# Altium schematic sheet Duubel_v3.SchDoc
size A4; SheetNumber: 1; SheetTotal: 1
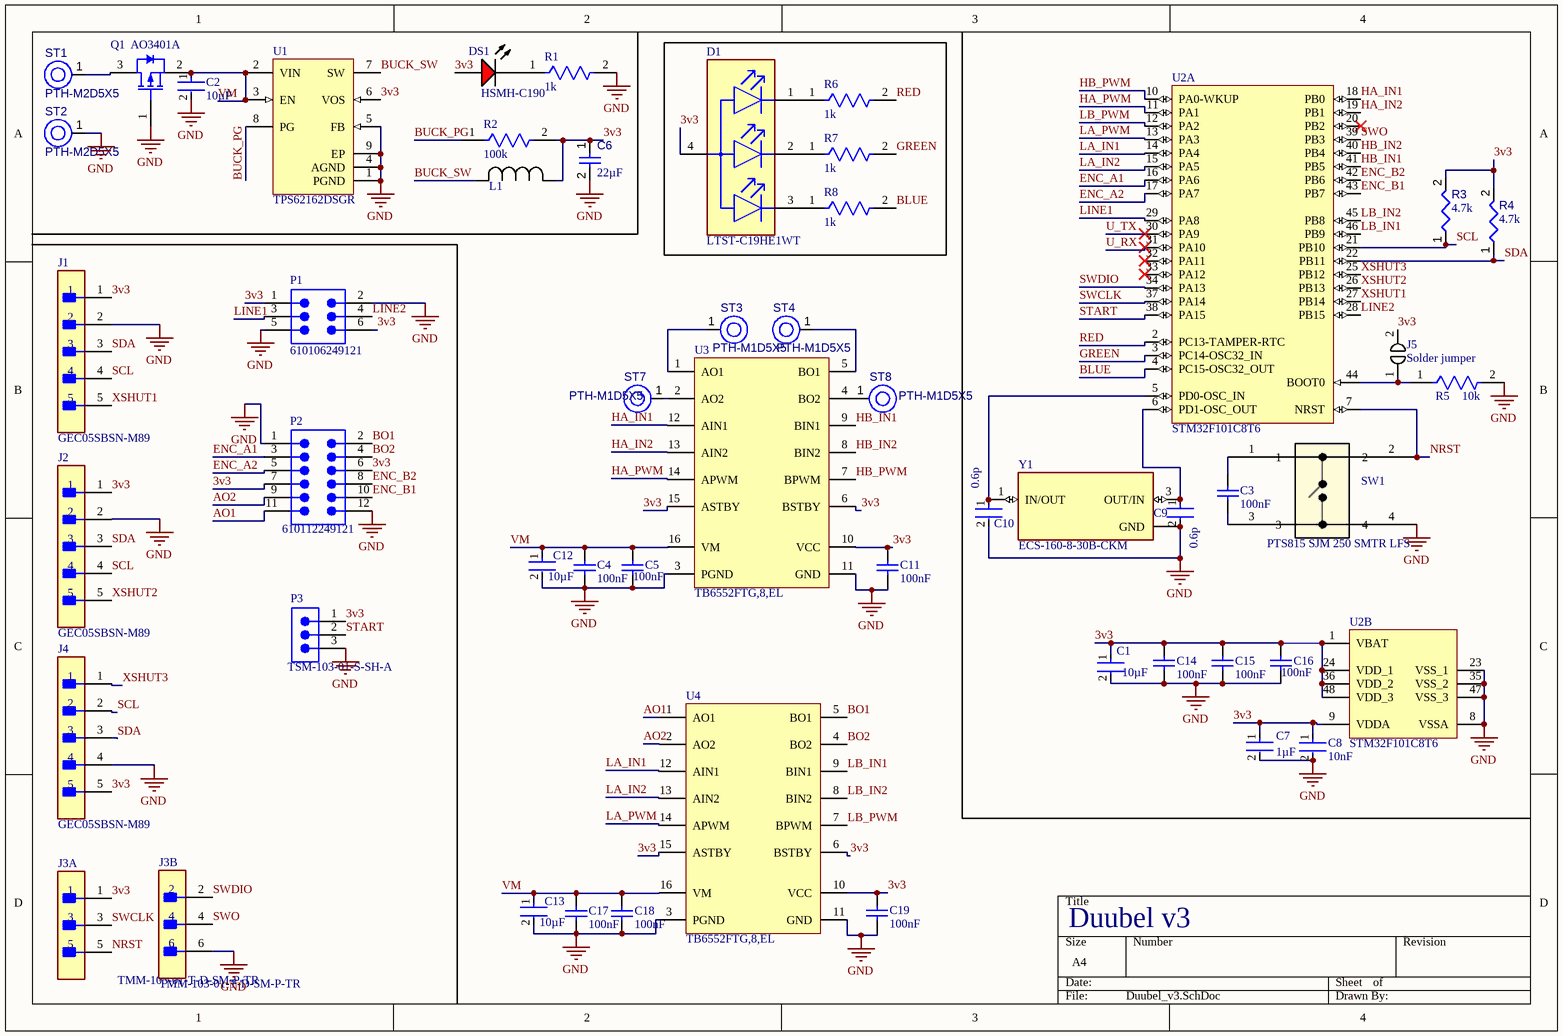
[diagram p0: Duubel_v3.SchDoc]

## Parts
C1  value 10µF  [FP-CL10-IPC_B]  (hidden comment: CL10A106KP8NNND)
C2  value 10µF  [FP-CL10-IPC_B]  (hidden comment: CL10A106KP8NNND)
C3  value 100nF  [CAPC1608X90X35LL15T15]  (hidden comment: 0603YC104MAT4A)
C4  value 100nF  [CAPC1608X90X35LL15T15]  (hidden comment: 0603YC104MAT4A)
C5  value 100nF  [CAPC1608X90X35LL15T15]  (hidden comment: 0603YC104MAT4A)
C6  value 22µF  [CAPC0805(2012)145_L]  (hidden comment: Capacitor 22µF +/-40% 16V 0805)
C7  value 1µF  [FP-0805-L_2_01_0_2-W_1_25-IPC_B]  (hidden comment: 08053C105K4Z2A)
C8  value 10nF  [FP-CL10-IPC_B]  (hidden comment: CL10B103KB8NFNC)
C9  0.6p  [FP-CGA3E-0_3-0_1-MFG]
C10  0.6p  [FP-CGA3E-0_3-0_1-MFG]
C11  value 100nF  [CAPC1608X90X35LL15T15]  (hidden comment: 0603YC104MAT4A)
C12  value 10µF  [FP-CL10-IPC_B]  (hidden comment: CL10A106KP8NNND)
C13  value 10µF  [FP-CL10-IPC_B]  (hidden comment: CL10A106KP8NNND)
C14  value 100nF  [CAPC1608X90X35LL15T15]  (hidden comment: 0603YC104MAT4A)
C15  value 100nF  [CAPC1608X90X35LL15T15]  (hidden comment: 0603YC104MAT4A)
C16  value 100nF  [CAPC1608X90X35LL15T15]  (hidden comment: 0603YC104MAT4A)
C17  value 100nF  [CAPC1608X90X35LL15T15]  (hidden comment: 0603YC104MAT4A)
C18  value 100nF  [CAPC1608X90X35LL15T15]  (hidden comment: 0603YC104MAT4A)
C19  value 100nF  [CAPC1608X90X35LL15T15]  (hidden comment: 0603YC104MAT4A)
D1  LTST-C19HE1WT  [FP-LTST-C19HE1WT-MFG]
DS1  HSMH-C190  [AVAG-HSMX-C190_V]
J1  GEC05SBSN-M89  [FP-GEC05SBSN-M89-MFG]
J2  GEC05SBSN-M89  [FP-GEC05SBSN-M89-MFG]
J3  TMM-103-01-T-D-SM-P-TR  [FP-TMM-103-01-T-D-SM-P-TR-MFG]  (parts A,B of 2)
J4  GEC05SBSN-M89  [FP-GEC05SBSN-M89-MFG]
J5  Solder jumper  [Solder jumper-Footprint-1]
L1  IHHP0805ZHER2R2M01  [IND_IHHP-0805ZH-01_VIS]  (value not drawn)
P1  610106249121  [610106249121]
P2  610112249121  [610112249121]
P3  TSM-103-01-S-SH-A  [SMTC-TSM-103-01-X-SH-A]
Q1  AO3401A  [AO-SOT-23-3L_V]
R1  value 1k  [FP-RCA0603-e3-IPC_B]  (hidden comment: RCA06031K00FKEA)
R2  value 100k  [FP-CRCW0603-HPe3-MFG]  (hidden comment: CRCW0603100KJNEAHP)
R3  value 4.7k  [RESC1608X55X25ML10T15]  (hidden comment: Resistor 4k7 +/-1% 0603 100 mW)
R4  value 4.7k  [RESC1608X55X25ML10T15]  (hidden comment: Resistor 4k7 +/-1% 0603 100 mW)
R5  value 10k  [FP-MCT0603-IPC_A]  (hidden comment: MCT06030E1002BP500)
R6  value 1k  [FP-RCA0603-e3-IPC_B]  (hidden comment: RCA06031K00FKEA)
R7  value 1k  [FP-RCA0603-e3-IPC_B]  (hidden comment: RCA06031K00FKEA)
R8  value 1k  [FP-RCA0603-e3-IPC_B]  (hidden comment: RCA06031K00FKEA)
ST1  PTH-M2D5X5  [PTH-M2D5X5]
ST2  PTH-M2D5X5  [PTH-M2D5X5]
ST3  PTH-M1D5X5  [PTH-M2D5X5]
ST4  PTH-M1D5X5  [PTH-M2D5X5]
ST7  PTH-M1D5X5  [PTH-M2D5X5]
ST8  PTH-M1D5X5  [PTH-M2D5X5]
SW1  PTS815 SJM 250 SMTR LFS  [SW4_PTS815 SJM 250 SMTR LFS_CNK]
U1  TPS62162DSGR  [DSG0008A_V]
U2  STM32F101C8T6  [STM-LQFP48_N]  (parts A,B of 2)
U3  TB6552FTG,8,EL  [QFN50P300X300X75_HS-17N]
U4  TB6552FTG,8,EL  [QFN50P300X300X75_HS-17N]
Y1  ECS-160-8-30B-CKM  [XTAL_ECS-160-8-30B-CKM]

## Nets
GND: C1.2 C2.2 C4.1 C5.1 C6.2 C7.2 C8.2 C9.2 C10.2 C11.1 C12.2 C13.2 C14.1 C15.1 C16.1 C17.1 C18.1 C19.1 J1.2 J2.2 J3.6 J4.4 P1.2 P1.5 P2.1 P2.12 P3.3 Q1.1(GATE) R1.2 R5.2 ST2.1(H1) SW1.4 U1.1(PGND) U1.4(AGND) U1.5(FB) U1.9(EP) U2.8(VSSA) U2.23(VSS_1) U2.35(VSS_2) U2.47(VSS_3) U3.3(PGND) U3.11(GND) U4.3(PGND) U4.11(GND) Y1.2(GND) Y1.4(GND)
3v3: C1.1 C6.1 C7.1 C8.1 C11.2 C14.2 C15.2 C16.2 C19.2 D1.4(A) DS1.1(A) J1.1 J2.1 J3.1 J4.5 J5.2 L1.1 P1.1 P1.6 P2.6 P2.7 P3.1 R2.2 R3.2 R4.2 U1.6(VOS) U2.1(VBAT) U2.9(VDDA) U2.24(VDD_1) U2.36(VDD_2) U2.48(VDD_3) U3.6(BSTBY) U3.10(VCC) U3.15(ASTBY) U4.6(BSTBY) U4.10(VCC) U4.15(ASTBY)
AO1: P2.11 U4.1(AO1)
AO2: P2.9 U4.2(AO2)
BLUE: R8.2 U2.4(PC15-OSC32_OUT)
BO1: P2.2 U4.5(BO1)
BO2: P2.4 U4.4(BO2)
BUCK_PG: R2.1 U1.8(PG)
BUCK_SW: L1.2 U1.7(SW)
ENC_A1: P2.3 U2.16(PA6)
ENC_A2: P2.5 U2.17(PA7)
ENC_B1: P2.10 U2.43(PB7)
ENC_B2: P2.8 U2.42(PB6)
GREEN: R7.2 U2.3(PC14-OSC32_IN)
HA_IN1: U2.18(PB0) U3.12(AIN1)
HA_IN2: U2.19(PB1) U3.13(AIN2)
HA_PWM: U2.11(PA1) U3.14(APWM)
HB_IN1: U2.41(PB5) U3.9(BIN1)
HB_IN2: U2.40(PB4) U3.8(BIN2)
HB_PWM: U2.10(PA0-WKUP) U3.7(BPWM)
LA_IN1: U2.14(PA4) U4.12(AIN1)
LA_IN2: U2.15(PA5) U4.13(AIN2)
LA_PWM: U2.13(PA3) U4.14(APWM)
LB_IN1: U2.46(PB9) U4.9(BIN1)
LB_IN2: U2.45(PB8) U4.8(BIN2)
LB_PWM: U2.12(PA2) U4.7(BPWM)
LINE1: P1.3 U2.29(PA8)
LINE2: P1.4 U2.28(PB15)
NRST: J3.5 SW1.2 U2.7(NRST)
RED: R6.2 U2.2(PC13-TAMPER-RTC)
SCL: J1.4 J2.4 J4.2 R3.1 U2.21(PB10)
SDA: J1.3 J2.3 J4.3 R4.1 U2.22(PB11)
START: P3.2 U2.38(PA15)
SWCLK: J3.3 U2.37(PA14)
SWDIO: J3.2 U2.34(PA13)
SWO: J3.4 U2.39(PB3)
U_RX: U2.31(PA10)
U_TX: U2.30(PA9)
VM: C2.1 C4.2 C5.2 C12.1 C13.1 C17.2 C18.2 Q1.2(SOURCE) U1.2(VIN) U1.3(EN) U3.16(VM) U4.16(VM)
XSHUT1: J1.5 U2.27(PB14)
XSHUT2: J2.5 U2.26(PB13)
XSHUT3: J4.1 U2.25(PB12)
NetC3_1: C3.1 SW1.3
NetC3_2: C3.2 SW1.1
NetC9_1: C9.1 U2.6(PD1-OSC_OUT) Y1.3(OUT/IN)
NetC10_1: C10.1 U2.5(PD0-OSC_IN) Y1.1(IN/OUT)
NetD1_1: D1.1(RED_C) R6.1
NetD1_2: D1.2(GREEN_C) R7.1
NetD1_3: D1.3(BLUE_C) R8.1
NetDS1_2: DS1.2(K) R1.1
NetJ5_1: J5.1 R5.1 U2.44(BOOT0)
NetQ1_3: Q1.3(DRAIN) ST1.1(H1)
NetST3_1: ST3.1(H1) U3.1(AO1)
NetST4_1: ST4.1(H1) U3.5(BO1)
NetST7_1: ST7.1(H1) U3.2(AO2)
NetST8_1: ST8.1(H1) U3.4(BO2)

Not connected (* = marked no-connect by the designer): U2 20(PB2)* 32(PA11)* 33(PA12)*

## Notes on the sheet
- Duubel v3

## Library data of the parts
C1 C2 C12 C13 = CMP-001-00093-1: Ceramic Capacitor, Multilayer, Ceramic, 10V, 10% +Tol, 10% -Tol, X5R, 15% TC, 10uF, Surface Mount, 0603; RoHS Compliant: Yes; Min Operating Temperature: -55°C; Max Operating Temperature: 85°C; Pins: 2; Mounting Technology: Surface Mount; Case/Package: 0603; Capacitor Type: Ceramic
C3-C5 C11 C14-C19 = CMP-001-00087-1: Ceramic Capacitor, Multilayer, Ceramic, 16V, 20% +Tol, 20% -Tol, X7R, 15% TC, 0.1uF, Surface Mount, 0603; Min Operating Temperature: -55°C; Case/Package: 0603; Mounting Technology: Surface Mount; Max Operating Temperature: 125°C; Capacitor Type: Ceramic; RoHS Compliant: Yes; Pins: 2
C6 = CMP-001-00081-4: Chip Capacitor, 22µF +/-40%, 16V, 0805, Thickness 1.45 mm; Tolerance: 5%; Voltage Rating: 16V; Mounting Technology: SMT; Pins: 2; Max Operating Temperature: 85°C; Case/Package: 0805; Min Operating Temperature: -55°C
C7 = CMP-001-00083-1: Ceramic Capacitor, Multilayer, Ceramic, 25V, 10% +Tol, 10% -Tol, X7R, 15% TC, 1uF, Surface Mount, 0805; Max Operating Temperature: 125°C; Min Operating Temperature: -55°C; Pins: 2; Mounting Technology: Surface Mount; RoHS Compliant: Yes; Capacitor Type: Ceramic; Case/Package: 0805
C8 = CMP-001-00092-1: Ceramic Capacitor, Multilayer, Ceramic, 50V, 10% +Tol, 10% -Tol, X7R, 15% TC, 0.01uF, Surface Mount, 0603; RoHS Compliant: Yes; Mounting Technology: Surface Mount; Min Operating Temperature: -55°C; Case/Package: 0603; Max Operating Temperature: 125°C; Capacitor Type: Ceramic; Pins: 2
C9 C10 = CMP-08246-001317-1: Cap Ceramic 6pF 50V C0G 0.5pF Pad SMD 0603 +125°C Automotive T/R; Weight: 7.1E-05oz; Capacitance: 6pF; Min Operating Temperature: -55°C; Termination: SMD/SMT; Mount: Surface Mount; Thickness: 0.035inch; Voltage Rating: 50V; Case Code (Metric): 1608; Package Quantity: 1; Length: 1.6mm; Dielectric: C0G; REACH SVHC: No SVHC; Packaging: Tape and Reel; Height: 0.8mm; Composition: Ceramic; Depth: 0.8mm; Case Code (Imperial): 0603; Case/Package: 0603; Max Operating Temperature: 125°C; Voltage Rating (DC): 50V; Ratings: AEC-Q200; Width: 0.031inch
D1 = CMP-007-00036-1: Single Color LED, White Diffused; Forward Current: 30mA; Forward Voltage: 2.4V; Min Operating Temperature: -20°C; Max Operating Temperature: 80°C; RoHS Compliant: Yes
DS1 = CMP-007-00014-2: LED Uni-Color Red, 65 mW, 20 mA, -40 to 85 degC, 2-Pin SMD, RoHS, Tape and Reel; Manufacturer: Avago; Nominal Vf: 1.8V; Luminous Intensity: 17mcd; Power: 78mW; Forward Current: 20mA; Lens Style: Diffused; Viewing Angle: 170degrees; Package Quantity: 4000; Colour: Red; Manufacturer URL: http://www.avagotech.com/; Min Operating Temperature: -40°C; Datasheet URL: http://docs.avagotech.com/docs/AV02-0551EN; RoHS Compliant: True; Forward Voltage: 1.8V; Pins: 2; Max Operating Temperature: 85°C; Packaging: TapeandReel; Package Reference: HSMX-C190; Datasheet Version: Mar-12; Package Description: 2-Pin Surface Mount Device, Body 1.6 x 0.8 mm, Height 0.9 mm; Case/Package: 0603; Mounting Technology: SM; Illumination Colour: Red
J1 J2 J4 = CMP-002-00083-1: Board Connector, 5 Contact(s), 1 Row(s), Male, Right Angle, Surface Mount Terminal; Connector Type: BOARD CONNECTOR; Mounting Technology: Board; RoHS Compliant: Yes
J3 = CMP-002-00080-1: Board Connector, 6 Contact(s), 2 Row(s), Male, Straight, 0.079 inch Pitch, Surface Mount Terminal, Black Insulator; RoHS Compliant: Yes; Mounting Technology: Board; Connector Type: BOARD CONNECTOR
J5 = CMP-00028-00007-4
L1 = CMP-006-00021-1: Power Inductor, 2.2UH, Shielded, 1.8A Rohs Compliant: Yes
P1 = CMP-002-00085-2: Board Connector, 6 Contact(s), 2 Row(s), Male, Right Angle, Surface Mount Terminal; Connector Type: BOARD CONNECTOR; RoHS Compliant: Yes; Mounting Technology: Board
P2 = CMP-002-00084-2: Board Connector, 12 Contact(s), 2 Row(s), Male, Right Angle, Surface Mount Terminal; Mounting Technology: Board; RoHS Compliant: Yes; Connector Type: BOARD CONNECTOR
P3 = CMP-002-00082-2: Board Connector, 3 Contact(s), 1 Row(s), Male, Right Angle, 0.1 inch Pitch, Surface Mount Terminal, Black Insulator; RoHS Compliant: Yes; Mounting Technology: Board; Connector Type: BOARD CONNECTOR
Q1 = CMP-013-00036-1: Small Signal Field-Effect Transistor, 4A I(D), 30V, 1-Element, P-Channel, Silicon, Metal-oxide Semiconductor FET; Max Operating Temperature: 150°C; Pins: 3; RoHS Compliant: Yes
R1 R6-R8 = CMP-009-00183-1: Fixed Resistor, Metal Glaze/thick Film, 0.1W, 1000ohm, 75V, 1% +/-Tol, 100ppm/Cel, Surface Mount, 0603; Power: 100mW; Case/Package: 0603; Tolerance: 1%; Pins: 2; Mounting Technology: Surface Mount; RoHS Compliant: Yes; Min Operating Temperature: -55°C; Max Operating Temperature: 155°C
R2 = CMP-009-00191-1: Fixed Resistor, Metal Glaze/thick Film, 0.33W, 100000ohm, 75V, 5% +/-Tol, 200ppm/Cel, Surface Mount, 0603; Power: 250mW; Pins: 2; Mounting Technology: Surface Mount; Case/Package: 0603; Min Operating Temperature: -55°C; RoHS Compliant: Yes; Tolerance: 5%; Max Operating Temperature: 155°C
R3 R4 = CMP-009-00031-5: Chip Resistor, 4.7 KOhm, +/- 1%, 0.1 W, -55 to 155 degC, 0603 (1608 Metric); Power: 100mW; Tolerance: 1%; Mounting Technology: SM; Case/Package: 0603; RoHS Compliant: True; Pins: 2; Min Operating Temperature: -55°C; Max Operating Temperature: 155°C
R5 = CMP-009-00182-1: Fixed Resistor, Thin Film, 0.1W, 10000ohm, 75V, 0.1% +/-Tol, 15ppm/Cel, Surface Mount, 0603; Power: 100mW; RoHS Compliant: Yes; Min Operating Temperature: -55°C; Case/Package: 0603; Tolerance: 0.1%; Pins: 2; Max Operating Temperature: 125°C; Mounting Technology: Surface Mount
ST1 ST2 = CMP-00028-00004-2: M2 PTH (2.5mm), 5mm pad; Pins: 1
ST3 ST4 ST7 ST8 = CMP-00028-00009-1: M1 PTH (2.5mm), 5mm pad; Pins: 1
SW1 = PTS815 SJM 250 SMTR LFS: No Description Available; Mfr_Name: C&K Components; RefDes: RefDes; Type: Type
U1 = CMP-019-00053-2: Switching Regulator, Current-mode, 1A, 2250kHz Switching Freq-Max, PDSO8; Max Supply Voltage: 17V; Pins: 8; Max Operating Temperature: 85°C; RoHS Compliant: Yes; Case/Package: HVSON; Min Operating Temperature: -40°C
U2 = CMP-020-00025-1: RISC Microcontroller, 32-Bit, FLASH, CORTEX-M3 CPU, 36MHz, CMOS, PQFP48; Nominal Supply Voltage: 3.3V; Min Supply Voltage: 2V; Max Supply Voltage: 3.6V; Clock Frequency: 16MHz; Min Operating Temperature: -40°C; Max Operating Temperature: 85°C; Case/Package: LFQFP; Pins: 48; RoHS Compliant: Yes
U3 U4 = CMP-00024-00006-2: Dual-bridge Driver IC For DC Motors
Y1 = ECS-160-8-30B-CKM: The ECX-53B is a miniature SMD Crystal with a 3.2 x 5 mm footprint. This package is ideal for todays compact wireless applications where board space is critical.; MF: {'manufacturer': u'ECS Inc.'}; Availability: Unavailable; Value: *; Package: None; Price: None; MP: ECS-160-8-30B-CKM